# Altium schematic sheet A7_CONNECTOR_V2.0.SchDoc
size A4
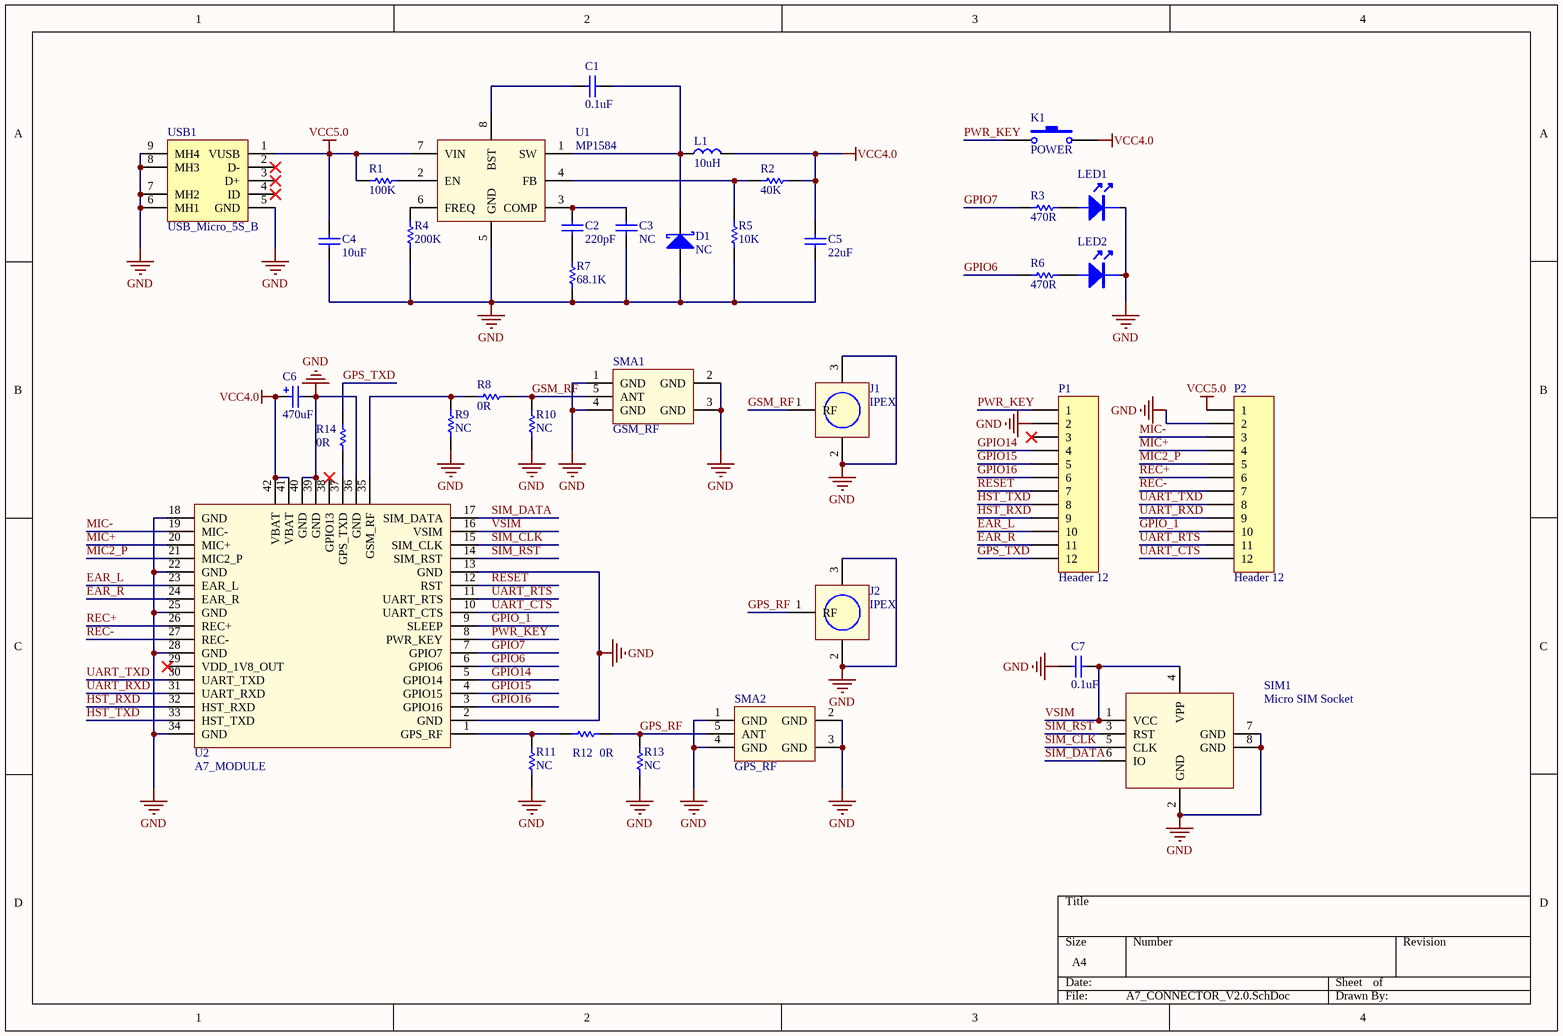
[diagram p0: A7_CONNECTOR_V2.0.SchDoc]

## Parts
C1  0.1uF  [C0402]
C2  220pF  [C0402]
C3  NC  [C0402]
C4  10uF  [C0603]
C5  22uF  [C0805]
C6  470uF  [D7343-31]
C7  0.1uF  [C0402]
D1  NC  [SOD-123]
J1  IPEX  [IPEX]
J2  IPEX  [IPEX]
K1  POWER  [KEY-6*6-SMD]
L1  10uH  [L0805]
LED1  (no value)  [LED_0603]
LED2  (no value)  [LED_0603]
P1  Header 12  [HDR1X12]
P2  Header 12  [HDR1X12]
R1  100K  [R0402]
R2  40K  [R0402]
R3  470R  [R0402]
R4  200K  [R0402]
R5  10K  [R0402]
R6  470R  [R0402]
R7  68.1K  [R0402]
R8  0R  [R0402]
R9  NC  [R0402]
R10  NC  [R0402]
R11  NC  [R0402]
R12  0R  [R0402]
R13  NC  [R0402]
R14  0R  [R0402]
SIM1  Micro SIM Socket  [SIM]
SMA1  GSM_RF  [SMA]
SMA2  GPS_RF  [SMA]
U1  MP1584  [SOIC8E]
U2  A7_MODULE  [A6_GPS_MODULE]
USB1  USB_Micro_5S_B  [USB_MICRO_5S_B]

## Nets
GND: C3.1 C4.1 C5.1 C6.2 C7.2 D1.1(A) J1.2(GND) J1.3(GND) J2.2(GND) J2.3(GND) LED1.2(K) LED2.2(K) P1.2 P2.2 R4.1 R5.1 R7.1 R9.1 R10.1 R11.1 R13.1 SIM1.2(GND) SIM1.7(GND) SIM1.8(GND) SMA1.1(GND) SMA1.2(GND) SMA1.3(GND) SMA1.4(GND) SMA2.1(GND) SMA2.2(GND) SMA2.3(GND) SMA2.4(GND) U1.5(GND) U2.2(GND) U2.13(GND) U2.18(GND) U2.22(GND) U2.25(GND) U2.28(GND) U2.34(GND) U2.36(GND) U2.39(GND) U2.40(GND) USB1.5(GND) USB1.6(MH1) USB1.7(MH2) USB1.8(MH3) USB1.9(MH4)
VCC4.0: C5.2 C6.1 K1.2 L1.1 R2.1 U2.41(VBAT) U2.42(VBAT)
VCC5.0: C4.2 P2.1 R1.1 U1.7(VIN) USB1.1(VUSB)
EAR_L: P1.10 U2.23(EAR_L)
EAR_R: P1.11 U2.24(EAR_R)
GPIO6: R6.1 U2.6(GPIO6)
GPIO7: R3.1 U2.7(GPIO7)
GPIO14: P1.4 U2.5(GPIO14)
GPIO15: P1.5 U2.4(GPIO15)
GPIO16: P1.6 U2.3(GPIO16)
GPIO_1: P2.10 U2.9(SLEEP)
GPS_RF: J2.1(RF) R12.2 R13.2 SMA2.5(ANT)
GPS_TXD: P1.12 R14.2
GSM_RF: J1.1(RF) R8.2 R10.2 SMA1.5(ANT)
HST_RXD: P1.9 U2.32(HST_RXD)
HST_TXD: P1.8 U2.33(HST_TXD)
MIC2_P: P2.5 U2.21(MIC2_P)
MIC+: P2.4 U2.20(MIC+)
MIC-: P2.3 U2.19(MIC-)
PWR_KEY: K1.1 P1.1 U2.8(PWR_KEY)
REC+: P2.6 U2.26(REC+)
REC-: P2.7 U2.27(REC-)
RESET: P1.7 U2.12(RST)
SIM_CLK: SIM1.5(CLK) U2.15(SIM_CLK)
SIM_DATA: SIM1.6(IO) U2.17(SIM_DATA)
SIM_RST: SIM1.3(RST) U2.14(SIM_RST)
UART_CTS: P2.12 U2.10(UART_CTS)
UART_RTS: P2.11 U2.11(UART_RTS)
UART_RXD: P2.9 U2.31(UART_RXD)
UART_TXD: P2.8 U2.30(UART_TXD)
VSIM: C7.1 SIM1.1(VCC) SIM1.4(VPP) U2.16(VSIM)
NetC1_1: C1.1 U1.8(BST)
NetC1_2: C1.2 D1.2(K) L1.2 U1.1(SW)
NetC2_1: C2.1 R7.2
NetC2_2: C2.2 C3.2 U1.3(COMP)
NetLED1_1: LED1.1(A) R3.2
NetLED2_1: LED2.1(A) R6.2
NetR1_2: R1.2 U1.2(EN)
NetR2_2: R2.2 R5.2 U1.4(FB)
NetR4_2: R4.2 U1.6(FREQ)
NetR8_1: R8.1 R9.2 U2.35(GSM_RF)
NetR11_2: R11.2 R12.1 U2.1(GPS_RF)
NetR14_1: R14.1 U2.37(GPS_TXD)

Not connected (* = marked no-connect by the designer): P1 3*; U2 29(VDD_1V8_OUT)* 38(GPIO13)*; USB1 2(D-)* 3(D+)* 4(ID)*

## Library data of the parts
C1-C5 C7 = Cap
C6 = Cap+
D1 = D Schottky: Schottky Diode; Published: 8-Jun-2000; LatestRevisionDate: 17-Jul-2002; LatestRevisionNote: Re-released for DXP Platform.; PackageReference: SMB; Publisher: Altium Limited; PackageDescription: DO-214-AA/SMB; 2 C-Bend Leads; Body 5.3 x 3.6 mm, inc. leads (LxW); Code_JEDEC: DO-214-AA
K1 = KEY: Published: 24-Mar-1999; LatestRevisionDate: 17-Jul-2002; LatestRevisionNote: Re-released for DXP Platform.; PackageReference: SPST-2; Publisher: Altium Limited; PackageDescription: Switch; 2 Leads
L1 = L
LED1 LED2 = LED: SMD0603 LED
P1 P2 = Header 12: Header, 12-Pin; LatestRevisionDate: 17-Jul-2002; LatestRevisionNote: Re-released for DXP Platform.; Publisher: Altium Limited
R1-R14 = Res
SIM1 = Micro SIM
SMA1 SMA2 = SMA
U2 = A6_GPS_MODULE
USB1 = USB_Micro_5S_B: USB micro female SMT with 4 fixed foot